# Altium schematic sheet PLD_AcessPortInterface.SchDoc: ADC for SunSref,Photodiodes and HK
size A4; SheetTotal: 32
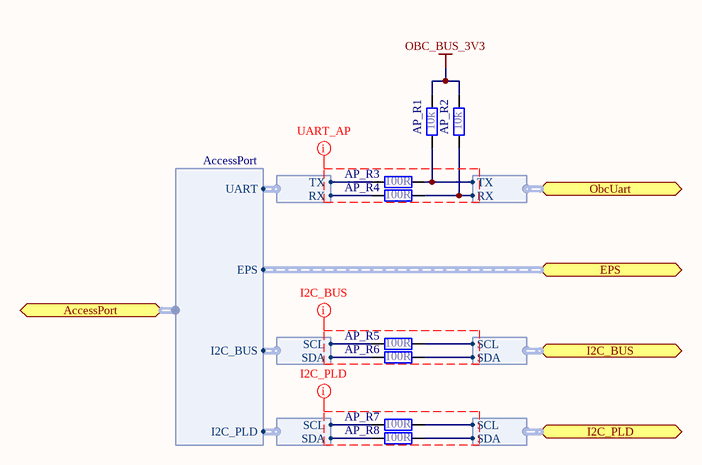
[diagram p0: PLD_AcessPortInterface.SchDoc]

## Parts
AP_R1  10k  [SMD_Resistor_0603]
AP_R2  10k  [SMD_Resistor_0603]
AP_R3  100R  [SMD_Resistor_0603]
AP_R4  100R  [SMD_Resistor_0603]
AP_R5  100R  [SMD_Resistor_0603]
AP_R6  100R  [SMD_Resistor_0603]
AP_R7  100R  [SMD_Resistor_0603]
AP_R8  100R  [SMD_Resistor_0603]

## Ports
AccessPort (harness AccessPort), EPS (harness EPS_ACCESSPORT), I2C_BUS (harness I2C), I2C_PLD (harness I2C), ObcUart (harness UART)

## Harnesses
I2C: SDA, SCL
UART: RX, TX
AccessPort: I2C_PLD, I2C_BUS, EPS, UART

## Nets
OBC_BUS_3V3: AP_R1.2 AP_R2.2
NetAP_R1_1: AP_R1.1 AP_R3.2 ; port ObcUart.TX
NetAP_R2_1: AP_R2.1 AP_R4.2 ; port ObcUart.RX
NetAP_R3_1: AP_R3.1 ; harness UART.TX
NetAP_R4_1: AP_R4.1 ; harness UART.RX
NetAP_R5_1: AP_R5.1 ; harness I2C.SCL
NetAP_R5_2: AP_R5.2 ; port I2C_BUS.SCL
NetAP_R6_1: AP_R6.1 ; harness I2C.SDA
NetAP_R6_2: AP_R6.2 ; port I2C_BUS.SDA
NetAP_R7_1: AP_R7.1 ; harness I2C.SCL
NetAP_R7_2: AP_R7.2 ; port I2C_PLD.SCL
NetAP_R8_1: AP_R8.1 ; harness I2C.SDA
NetAP_R8_2: AP_R8.2 ; port I2C_PLD.SDA

## Layout directives
net class I2C_BUS: (no net found under the mark)
net class I2C_PLD: (no net found under the mark)
net class UART_AP: (no net found under the mark)

## Notes on the sheet
- Title:
- Project:
- Author:
- Model:
- Document Number:
- Checked by:
- Rev:
- Date:
- Approved by:
- Sheet:
- of
- File name:

## Library data of the parts
AP_R1-AP_R8 = Res: Package: 0603
  AP_R1 AP_R2: Value: 10k
  AP_R3-AP_R8: Value: 100R